# EAGLE design Final (EAGLE 9.2.0)
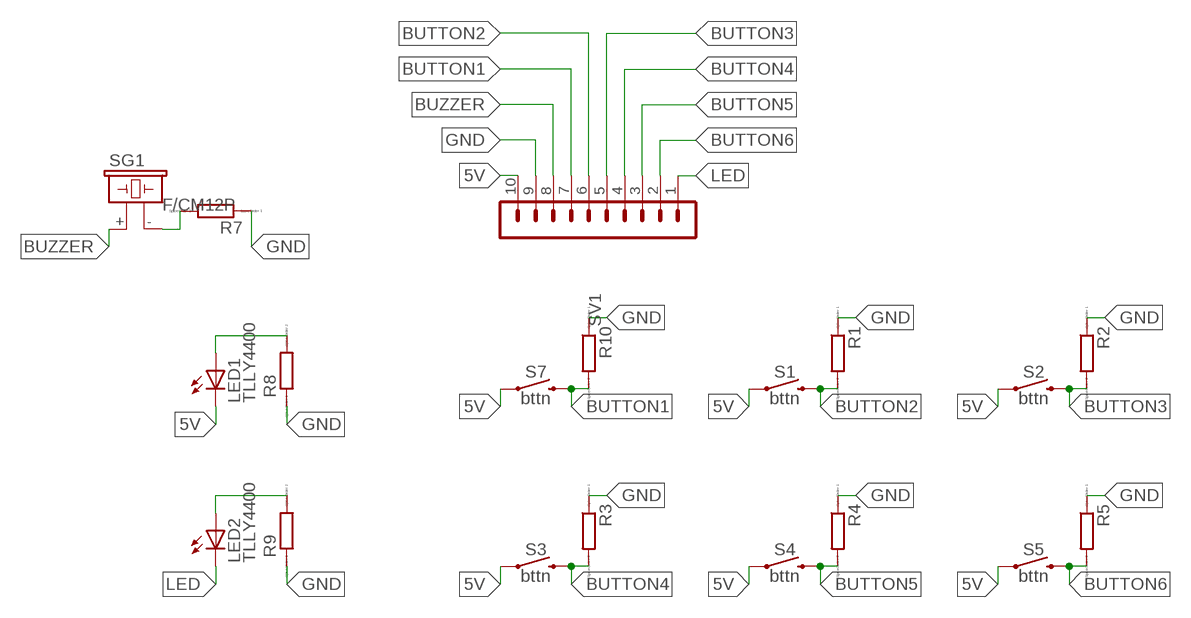
[diagram p0: schematic, sheet 1]

## Parts
LED1  TLLY4400  [LED3MM]
LED2  TLLY4400  [LED3MM]
R1  R0204/7  [0204/7]
R2  R0204/7  [0204/7]
R3  R0204/7  [0204/7]
R4  R0204/7  [0204/7]
R5  R0204/7  [0204/7]
R7  R0204/7  [0204/7]
R8  R0204/7  [0204/7]
R9  R0204/7  [0204/7]
R10  R0204/7  [0204/7]
S1  bttn  MOMENTARY-SWITCH-SPST-PTH-6.0MM  [TACTILE_SWITCH_PTH_6.0MM]
S2  bttn  MOMENTARY-SWITCH-SPST-PTH-6.0MM  [TACTILE_SWITCH_PTH_6.0MM]
S3  bttn  MOMENTARY-SWITCH-SPST-PTH-6.0MM  [TACTILE_SWITCH_PTH_6.0MM]
S4  bttn  MOMENTARY-SWITCH-SPST-PTH-6.0MM  [TACTILE_SWITCH_PTH_6.0MM]
S5  bttn  MOMENTARY-SWITCH-SPST-PTH-6.0MM  [TACTILE_SWITCH_PTH_6.0MM]
S7  bttn  MOMENTARY-SWITCH-SPST-PTH-6.0MM  [TACTILE_SWITCH_PTH_6.0MM]
SG1  F/CM12P  [F/CM12P]
SV1  MA10-1  [MA10-1]

## Nets
5V: LED1.K(C) S1.1 S2.1 S3.1 S4.1 S5.1 S7.1 SV1.10
BUTTON1: R10.2 S7.3 SV1.7
BUTTON2: R1.2 S1.3 SV1.6
BUTTON3: R2.2 S2.3 SV1.5
BUTTON4: R3.2 S3.3 SV1.4
BUTTON5: R4.2 S4.3 SV1.3
BUTTON6: R5.2 S5.3 SV1.2
BUZZER: SG1.+ SV1.8
GND: R1.1 R2.1 R3.1 R4.1 R5.1 R7.1 R8.1 R9.1 R10.1 SV1.9
LED: LED2.K(C) SV1.1
N$1: R7.2 SG1.-
N$2: LED2.A R9.2
N$3: LED1.A R8.2

## Library data of the parts
LED1 LED2 = led:TLLY4400: Low Current (2mA) LED 3 mm Tinted Diffused Package color YELLOW Source: Data sheet <http://www.farnell.com/datasheets/391098.pdf>; MF: VISHAY SEMICONDUCTOR; OC_FARNELL: 1612439
R1-R5 R7-R10 = eagle-ltspice:R: RESISTOR, European symbol; SPICEMODEL: NONE; SPICEPREFIX: R
S1-S5 S7 = SparkFun-Switches:MOMENTARY-SWITCH-SPST: Momentary Switch (Pushbutton) - SPST Normally-open (NO) SPST momentary switches (buttons, pushbuttons). Variants PTH-12MM - 12mm square, through-hole Momentary Pushbutton Switch - 12mm Square <https://www.sparkfun.com/products/9190> (COM-09190) PTH-6.0MM, PTH-6.0MM-KIT - 6.0mm square, through-hole Mini Pushbutton Switch <https://www.sparkfun.com/products/97> (COM-00097) KIT package intended for soldering kit's - only one side of pads' copper is exposed. PTH-RIGHT-ANGLE-KIT - Right-angle, through-hole Right Angle Tactile Button <https://www.sparkfun.com/products/10791> - Used on SparkFun BigTime Watch Kit <https://www.sparkfun.com/products/11734> SMD-12MM - 12mm square, surface-mount Tactile Button - SMD (12mm) <https://www.sparkfun.com/products/12993> (COM-12993) Used on SparkFun PicoBoard <https://www.sparkfun.com/products/11888> SMD-4.5MM - 4.5mm Square Trackball Switch Used on SparkFun Blackberry Trackballer Breakout <https://www.sparkfun.com/products/13169> SMD-4.6MMX2.8MM - 4.60mm x 2.80mm, surface mount Used on SparkFun SAMD21 Mini Breakout <https://www.sparkfun.com/products/13664> SMD-5.2MM, SMD-5.2-REDUNDANT - 5.2mm square, surface-mount Mini Pushbutton Switch - SMD <https://www.sparkfun.com/products/8720> (COM-08720) Used on Arduino Pro Mini <https://www.sparkfun.com/products/11114> REDUNDANT package connects both switch circuits together SMD-6.0X3.5MM - 6.0 x 3.5mm, surface mount Momentary Reset Switch SMD <https://www.sparkfun.com/products/8229> (COM-08229) SMD-6.2MM-TALL - 6.2mm square, surface mount Tactile Button - SMD (6mm) <https://www.sparkfun.com/products/12992> Used on SparkFun Digital Sandbox <https://www.sparkfun.com/products/12651> SMD-RIGHT-ANGLE - Right-angle, surface mount Used on SparkFun Block for Intel® Edison - Arduino <https://www.sparkfun.com/products/13036>; PROD_ID: SWCH-08441; SF_SKU: COM-00097
SG1 = buzzer:F/CM12P: BUZZER Source: Buerklin; OC_FARNELL: unknown; OC_NEWARK: unknown
SV1 = con-lstb:MA10-1: PIN HEADER; OC_FARNELL: unknown; OC_NEWARK: unknown

## Board
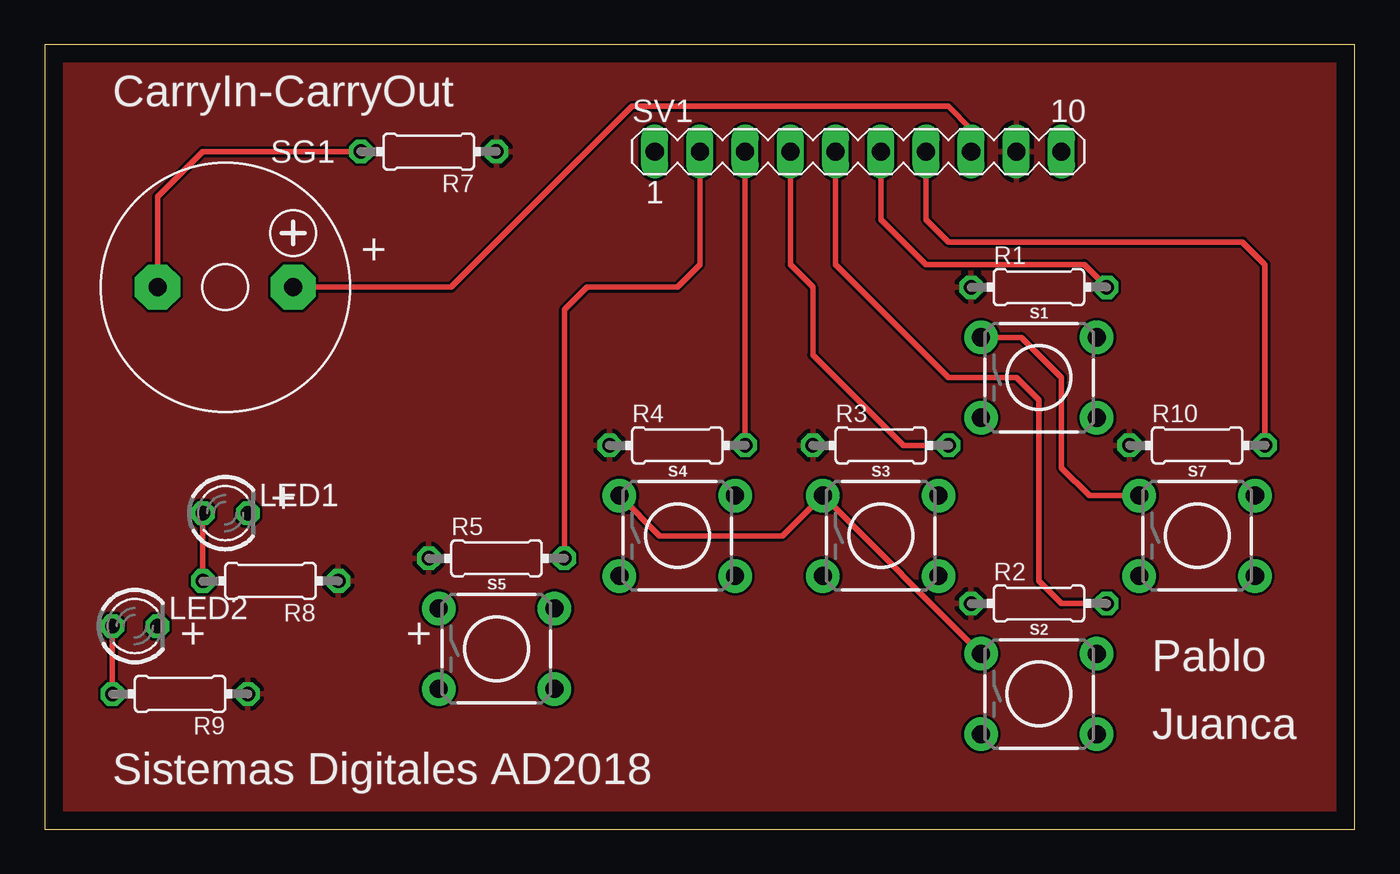
[diagram p1: board, top side]
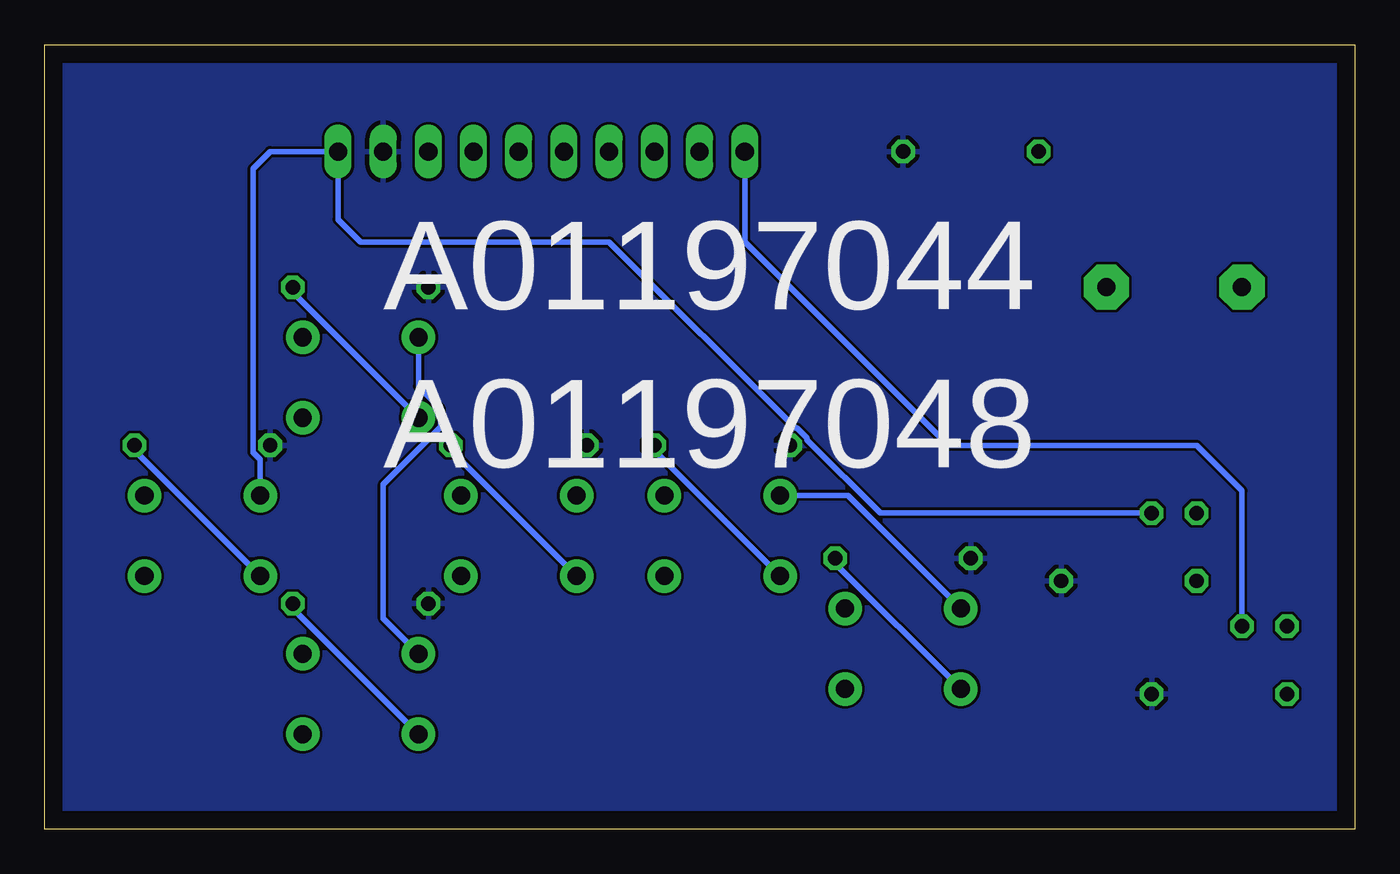
[diagram p2: board, bottom side, seen from below]

Size 73.64 x 44.12 mm. Coordinates in mm from the lower left corner, seen from the top.
Outline: 0,0 73.64,0 73.64,44.12 0,44.12 0,0
Copper layers (1*16): Top 0.035mm / dielectric 1.5mm / Bottom 0.035mm
Design rules "default": minimum track width 6mil, minimum drill 0.35mm, track to track 6mil, track to pad 6mil, pad to pad 6mil, via to via 6mil, smd to smd 6mil, copper to edge 40mil, drill to drill 6mil, minimum pad ring 10mil, minimum via ring 8mil, stop-mask expansion 4mil, vias tented up to drill 0mil, thermal gap 10mil

### Footprints (pad centres in the part's own frame; a part is rotated, then mirrored left to right if it is on the bottom)
LED3MM = drill 0.813 octagon: A -1.27,0; K 1.27,0
0204/7 = drill 0.813 octagon: 1 -3.81,0; 2 3.81,0
TACTILE_SWITCH_PTH_6.0MM = drill 1.016 pad 1.88: 1 -3.251,2.261; 2 3.251,2.261; 3 -3.251,-2.261; 4 3.251,-2.261
F/CM12P = drill 1.016 pad 2.54 octagon: + 3.81,0; - -3.81,0
MA10-1 = drill 1.016 long: 1 -11.43,0; 2 -8.89,0; 3 -6.35,0; 4 -3.81,0; 5 -1.27,0; 6 1.27,0; 7 3.81,0; 8 6.35,0; 9 8.89,0; 10 11.43,0

### Placement (x,y rotation side)
LED1  10.16,17.78 0 top
LED2  5.08,11.43 0 top
R1  55.88,30.48 0 top
R2  55.88,12.7 0 top
R3  46.99,21.59 0 top
R4  35.56,21.59 0 top
R5  25.4,15.24 0 top
R7  21.59,38.1 180 top
R8  12.7,13.97 180 top
R9  7.62,7.62 180 top
R10  64.77,21.59 0 top
S1  55.88,25.4 0 top
S2  55.88,7.62 0 top
S3  46.99,16.51 0 top
S4  35.56,16.51 0 top
S5  25.4,10.16 0 top
S7  64.77,16.51 0 top
SG1  10.16,30.48 0 top
SV1  45.72,38.1 0 top

### Tracks (layer width: path | path; a pad name or v marks a point on that pad's centre or on a via)
5V
  Top 0.305: S4.1 34.57,16.51 41.48,16.51 S3.1 S2.1 | S1.1 54.89,27.66 57.15,25.4 57.15,20.32 58.7,18.77 S7.1
  Bottom 0.305: LED1.K 26.67,17.78 30.78,21.89 30.78,21.99 31.35,22.56 31.45,22.56 41.91,33.02 55.88,33.02 57.15,34.29 SV1.10 60.96,38.1 61.93,37.14 61.93,21.19 61.52,20.78 S7.1 | S5.1 28.5,18.77 S4.1 | S1.1 52.63,24.9 51.38,23.65 51.38,22.62 54.61,19.4 54.61,11.86 S2.1
BUTTON1
  Top 0.305: R10.2 68.58,31.75 67.31,33.02 50.8,33.02 49.53,34.29 SV1.7
  Bottom 0.305: S7.3 68.58,21.31 R10.2
BUTTON2
  Top 0.305: SV1.6 46.99,34.29 49.53,31.75 58.42,31.75 R1.2
  Bottom 0.305: S1.3 59.69,30.2 R1.2
BUTTON3
  Top 0.305: SV1.5 44.45,31.75 50.8,25.4 54.61,25.4 55.88,24.13 55.88,13.97 57.15,12.7 R2.2
  Bottom 0.305: S2.3 59.69,12.42 R2.2
BUTTON4
  Top 0.305: R3.2 48.26,21.59 43.18,26.67 43.18,30.48 41.91,31.75 SV1.4
  Bottom 0.305: S3.3 50.8,21.31 R3.2
BUTTON5
  Top 0.305: SV1.3 R4.2
  Bottom 0.305: S4.3 39.37,21.31 R4.2
BUTTON6
  Top 0.305: R5.2 29.21,29.21 30.48,30.48 35.56,30.48 36.83,31.75 SV1.2
  Bottom 0.305: S5.3 29.21,14.96 R5.2
BUZZER
  Top 0.305: SV1.8 52.07,39.37 50.8,40.64 33.02,40.64 22.86,30.48 SG1.+
GND
  pour Top: 0,44.45 0,0 73.66,0 73.66,44.45
  pour Bottom: 0,44.45 73.66,44.45 73.66,0 0,0
LED
  Bottom 0.305: LED2.K 6.35,19.05 8.89,21.59 22.86,21.59 34.29,33.02 SV1.1
N$1
  Top 0.305: SG1.- 6.35,35.56 8.89,38.1 R7.2
N$2
  Top 0.305: LED2.A R9.2
N$3
  Top 0.305: LED1.A R8.2

### Text on the board
tNames: CarryIn-CarryOut | + | + | + | + | Pablo | Juanca | Sistemas Digitales AD2018
bNames: A01197044 | A01197048